# Altium schematic sheet MCU.SchDoc
size Tabloid; SheetNumber: 2; SheetTotal: 2
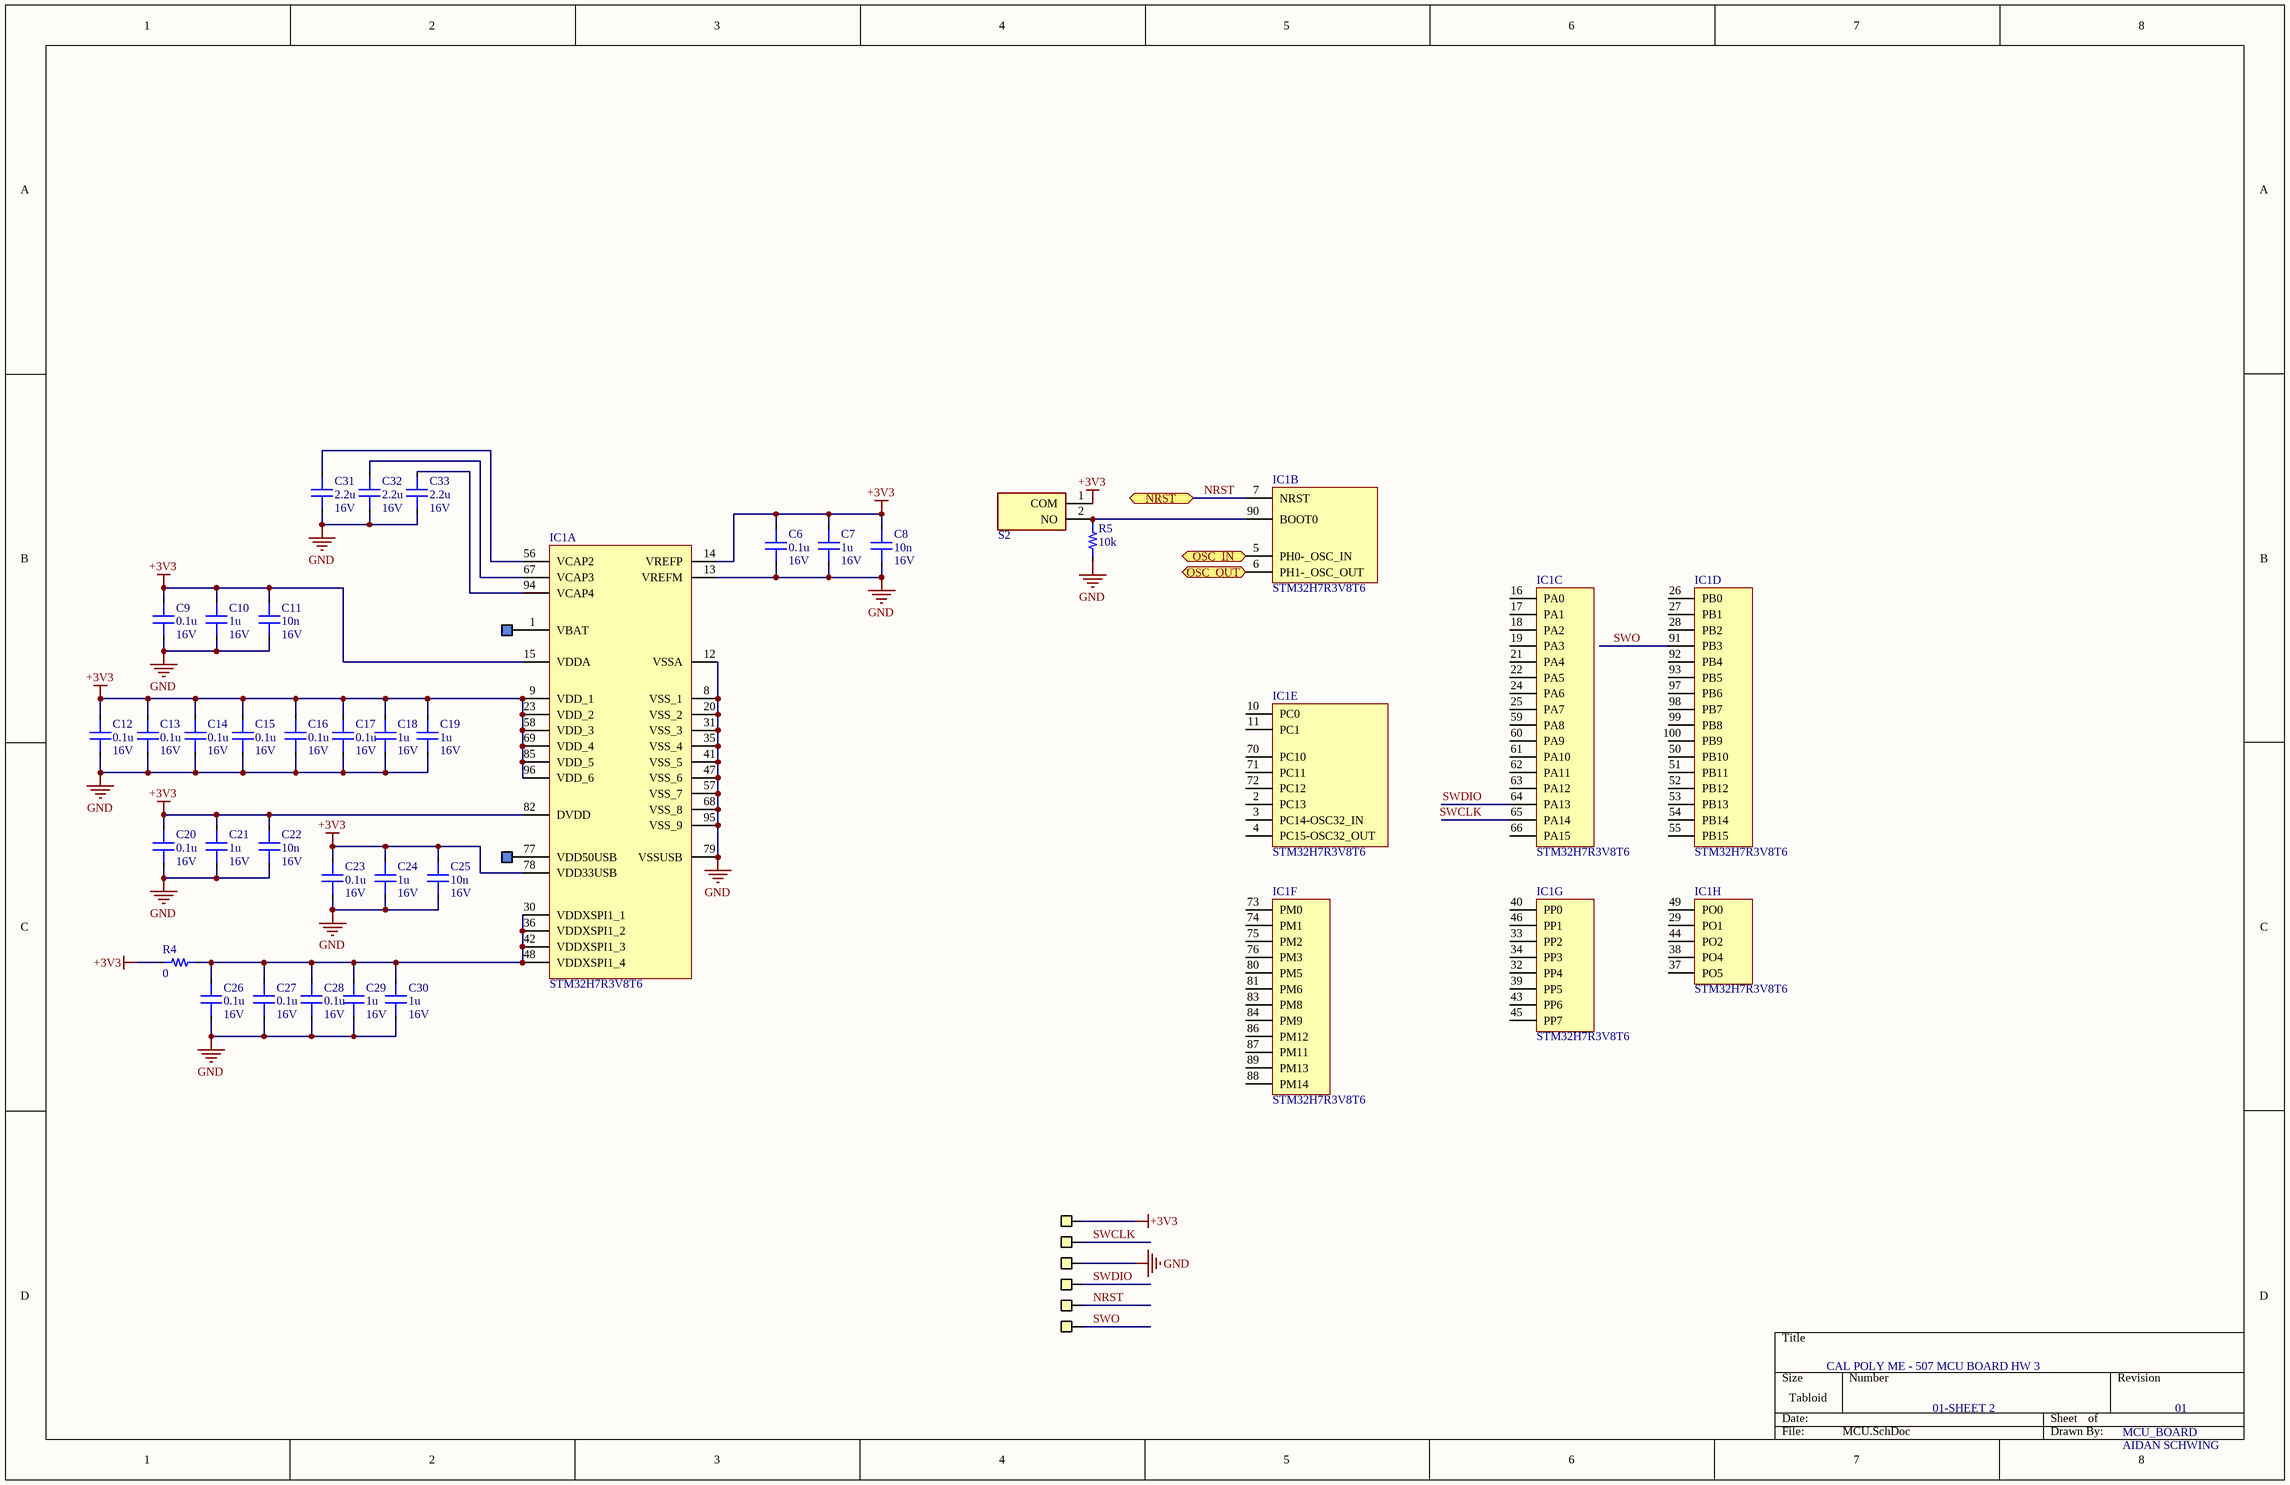
[diagram p0: MCU.SchDoc]

## Parts
C6  value 0.1u  Voltage: 16V  [0603_CAP]  (hidden comment: Capacitor)
C7  value 1u  Voltage: 16V  [0603_CAP]  (hidden comment: Capacitor)
C8  value 10n  Voltage: 16V  [0603_CAP]  (hidden comment: Capacitor)
C9  value 0.1u  Voltage: 16V  [0603_CAP]  (hidden comment: Capacitor)
C10  value 1u  Voltage: 16V  [0603_CAP]  (hidden comment: Capacitor)
C11  value 10n  Voltage: 16V  [0603_CAP]  (hidden comment: Capacitor)
C12  value 0.1u  Voltage: 16V  [0603_CAP]  (hidden comment: Capacitor)
C13  value 0.1u  Voltage: 16V  [0603_CAP]  (hidden comment: Capacitor)
C14  value 0.1u  Voltage: 16V  [0603_CAP]  (hidden comment: Capacitor)
C15  value 0.1u  Voltage: 16V  [0603_CAP]  (hidden comment: Capacitor)
C16  value 0.1u  Voltage: 16V  [0603_CAP]  (hidden comment: Capacitor)
C17  value 0.1u  Voltage: 16V  [0603_CAP]  (hidden comment: Capacitor)
C18  value 1u  Voltage: 16V  [0603_CAP]  (hidden comment: Capacitor)
C19  value 1u  Voltage: 16V  [0603_CAP]  (hidden comment: Capacitor)
C20  value 0.1u  Voltage: 16V  [0603_CAP]  (hidden comment: Capacitor)
C21  value 1u  Voltage: 16V  [0603_CAP]  (hidden comment: Capacitor)
C22  value 10n  Voltage: 16V  [0603_CAP]  (hidden comment: Capacitor)
C23  value 0.1u  Voltage: 16V  [0603_CAP]  (hidden comment: Capacitor)
C24  value 1u  Voltage: 16V  [0603_CAP]  (hidden comment: Capacitor)
C25  value 10n  Voltage: 16V  [0603_CAP]  (hidden comment: Capacitor)
C26  value 0.1u  Voltage: 16V  [0603_CAP]  (hidden comment: Capacitor)
C27  value 0.1u  Voltage: 16V  [0603_CAP]  (hidden comment: Capacitor)
C28  value 0.1u  Voltage: 16V  [0603_CAP]  (hidden comment: Capacitor)
C29  value 1u  Voltage: 16V  [0603_CAP]  (hidden comment: Capacitor)
C30  value 1u  Voltage: 16V  [0603_CAP]  (hidden comment: Capacitor)
C31  value 2.2u  Voltage: 16V  [0603_CAP]  (hidden comment: Capacitor)
C32  value 2.2u  Voltage: 16V  [0603_CAP]  (hidden comment: Capacitor)
C33  value 2.2u  Voltage: 16V  [0603_CAP]  (hidden comment: Capacitor)
IC1  STM32H7R3V8T6  [QFP50P1600X1600X160-100N]  (parts A,B,C,D,E,F,G,H of 8)
R4  value 0  [0805_RES]  (hidden comment: Resistor)
R5  value 10k  [0603_RES]  (hidden comment: Resistor)
S2  DS04-254-2-01BK-SMT-TR  [DS04254201BKSMTTR]  (value not drawn)
X2  HeaderPad  [HeaderPad]  (value not drawn)
X3  HeaderPad  [HeaderPad]  (value not drawn)
X4  GenericPinHeader(0.1in)  [GenericPinHeader(.1in)]  (value not drawn)
X5  GenericPinHeader(0.1in)  [GenericPinHeader(.1in)]  (value not drawn)
X6  GenericPinHeader(0.1in)  [GenericPinHeader(.1in)]  (value not drawn)
X7  GenericPinHeader(0.1in)  [GenericPinHeader(.1in)]  (value not drawn)
X8  GenericPinHeader(0.1in)  [GenericPinHeader(.1in)]  (value not drawn)
X9  GenericPinHeader(0.1in)  [GenericPinHeader(.1in)]  (value not drawn)

## Ports
NRST (bidir, see main_schematic[2C]), OSC_IN (bidir, see main_schematic[3C]), OSC_OUT (bidir, see main_schematic[3C])

## Nets
+3V3: C6.2 C7.2 C8.2 C9.2 C10.2 C11.2 C12.2 C13.2 C14.2 C15.2 C16.2 C17.2 C18.2 C19.2 C20.2 C21.2 C22.2 C23.2 C24.2 C25.2 IC1.9(VDD_1) IC1.14(VREFP) IC1.15(VDDA) IC1.23(VDD_2) IC1.58(VDD_3) IC1.69(VDD_4) IC1.78(VDD33USB) IC1.82(DVDD) IC1.85(VDD_5) IC1.96(VDD_6) R4.1 S2.1(COM) X4.1(Pin)
GND: C6.1 C7.1 C8.1 C9.1 C10.1 C11.1 C12.1 C13.1 C14.1 C15.1 C16.1 C17.1 C18.1 C19.1 C20.1 C21.1 C22.1 C23.1 C24.1 C25.1 C26.1 C27.1 C28.1 C29.1 C30.1 C31.1 C32.1 C33.1 IC1.8(VSS_1) IC1.12(VSSA) IC1.13(VREFM) IC1.20(VSS_2) IC1.31(VSS_3) IC1.35(VSS_4) IC1.41(VSS_5) IC1.47(VSS_6) IC1.57(VSS_7) IC1.68(VSS_8) IC1.79(VSSUSB) IC1.95(VSS_9) R5.1 X6.1(Pin)
NRST: IC1.7(NRST) X8.1(Pin) ; port NRST
OSC_IN: IC1.5(PH0-_OSC_IN) ; port OSC_IN
OSC_OUT: IC1.6(PH1-_OSC_OUT) ; port OSC_OUT
SWCLK: IC1.65(PA14) X5.1(Pin)
SWDIO: IC1.64(PA13) X7.1(Pin)
SWO: IC1.91(PB3) X9.1(Pin)
NetC26_2: C26.2 C27.2 C28.2 C29.2 C30.2 IC1.30(VDDXSPI1_1) IC1.36(VDDXSPI1_2) IC1.42(VDDXSPI1_3) IC1.48(VDDXSPI1_4) R4.2
NetC31_2: C31.2 IC1.56(VCAP2)
NetC32_2: C32.2 IC1.67(VCAP3)
NetC33_2: C33.2 IC1.94(VCAP4)
NetIC1_1: IC1.1(VBAT) X2.1(Pin)
NetIC1_77: IC1.77(VDD50USB) X3.1(Pin)
NetIC1_90: IC1.90(BOOT0) R5.2 S2.2(NO)

Not connected (* = marked no-connect by the designer): IC1 2(PC13) 3(PC14-OSC32_IN) 4(PC15-OSC32_OUT) 10(PC0) 11(PC1) 16(PA0) 17(PA1) 18(PA2) 19(PA3) 21(PA4) 22(PA5) 24(PA6) 25(PA7) 26(PB0) 27(PB1) 28(PB2) 29(PO1) 32(PP4) 33(PP2) 34(PP3) 37(PO5) 38(PO4) 39(PP5) 40(PP0) 43(PP6) 44(PO2) 45(PP7) 46(PP1) 49(PO0) 50(PB10) 51(PB11) 52(PB12) 53(PB13) 54(PB14) 55(PB15) 59(PA8) 60(PA9) 61(PA10) 62(PA11) 63(PA12) 66(PA15) 70(PC10) 71(PC11) 72(PC12) 73(PM0) 74(PM1) 75(PM2) 76(PM3) 80(PM5) 81(PM6) 83(PM8) 84(PM9) 86(PM12) 87(PM11) 88(PM14) 89(PM13) 92(PB4) 93(PB5) 97(PB6) 98(PB7) 99(PB8) 100(PB9)

## Notes on the sheet
- CAL POLY ME - 507 MCU BOARD HW 3
- 01-SHEET 2
- MCU_BOARD
- 01
- AIDAN SCHWING

## Library data of the parts
IC1 = STM32H7R3V8T6: IC MCU 32BIT 64KB FLASH 100LQFP; Manufacturer_Name: STMicroelectronics; Datasheet Link: https://www.st.com/resource/en/datasheet/stm32h7r3a8.pdf; Height: 1.6mm; Manufacturer_Part_Number: STM32H7R3V8T6
S2 = DS04-254-2-01BK-SMT-TR: DIP Switches / SIP Switches DIP Switch, SPST, 2.54 pitch, flat actuator, SMT, Tape and reel, 1 position, Black; Manufacturer_Name: CUI Devices; Datasheet Link: https://www.cuidevices.com/product/resource/supplyframepdf/ds04-254-smt.pdf; Height: 4.3mm; Manufacturer_Part_Number: DS04-254-2-01BK-SMT-TR; Mouser Part Number: 490-DS04254201BK-STR; Mouser Price/Stock: https://www.mouser.co.uk/ProductDetail/CUI-Devices/DS04-254-2-01BK-SMT-TR?qs=wnTfsH77Xs4xXRFXKF0ssg%3D%3D; Arrow Part Number: DS04-254-2-01BK-SMT-TR; Arrow Price/Stock: https://www.arrow.com/en/products/ds04-254-2-01bk-smt-tr/cui-devices?region=nac
X2 X3 = HeaderPad: Pad for pin header
X4-X9 = GenericPinHeader(0.1in): Generic .1in(2.54mm) pitch pin header
C6-C33 = Capacitor: Dielectric: *; Percent Tolerance: *; ESR: *
R4 R5 = Resistor: Tolerance: *